# EAGLE design 89c2051-ibm3104-ps2 (EAGLE 4.16)
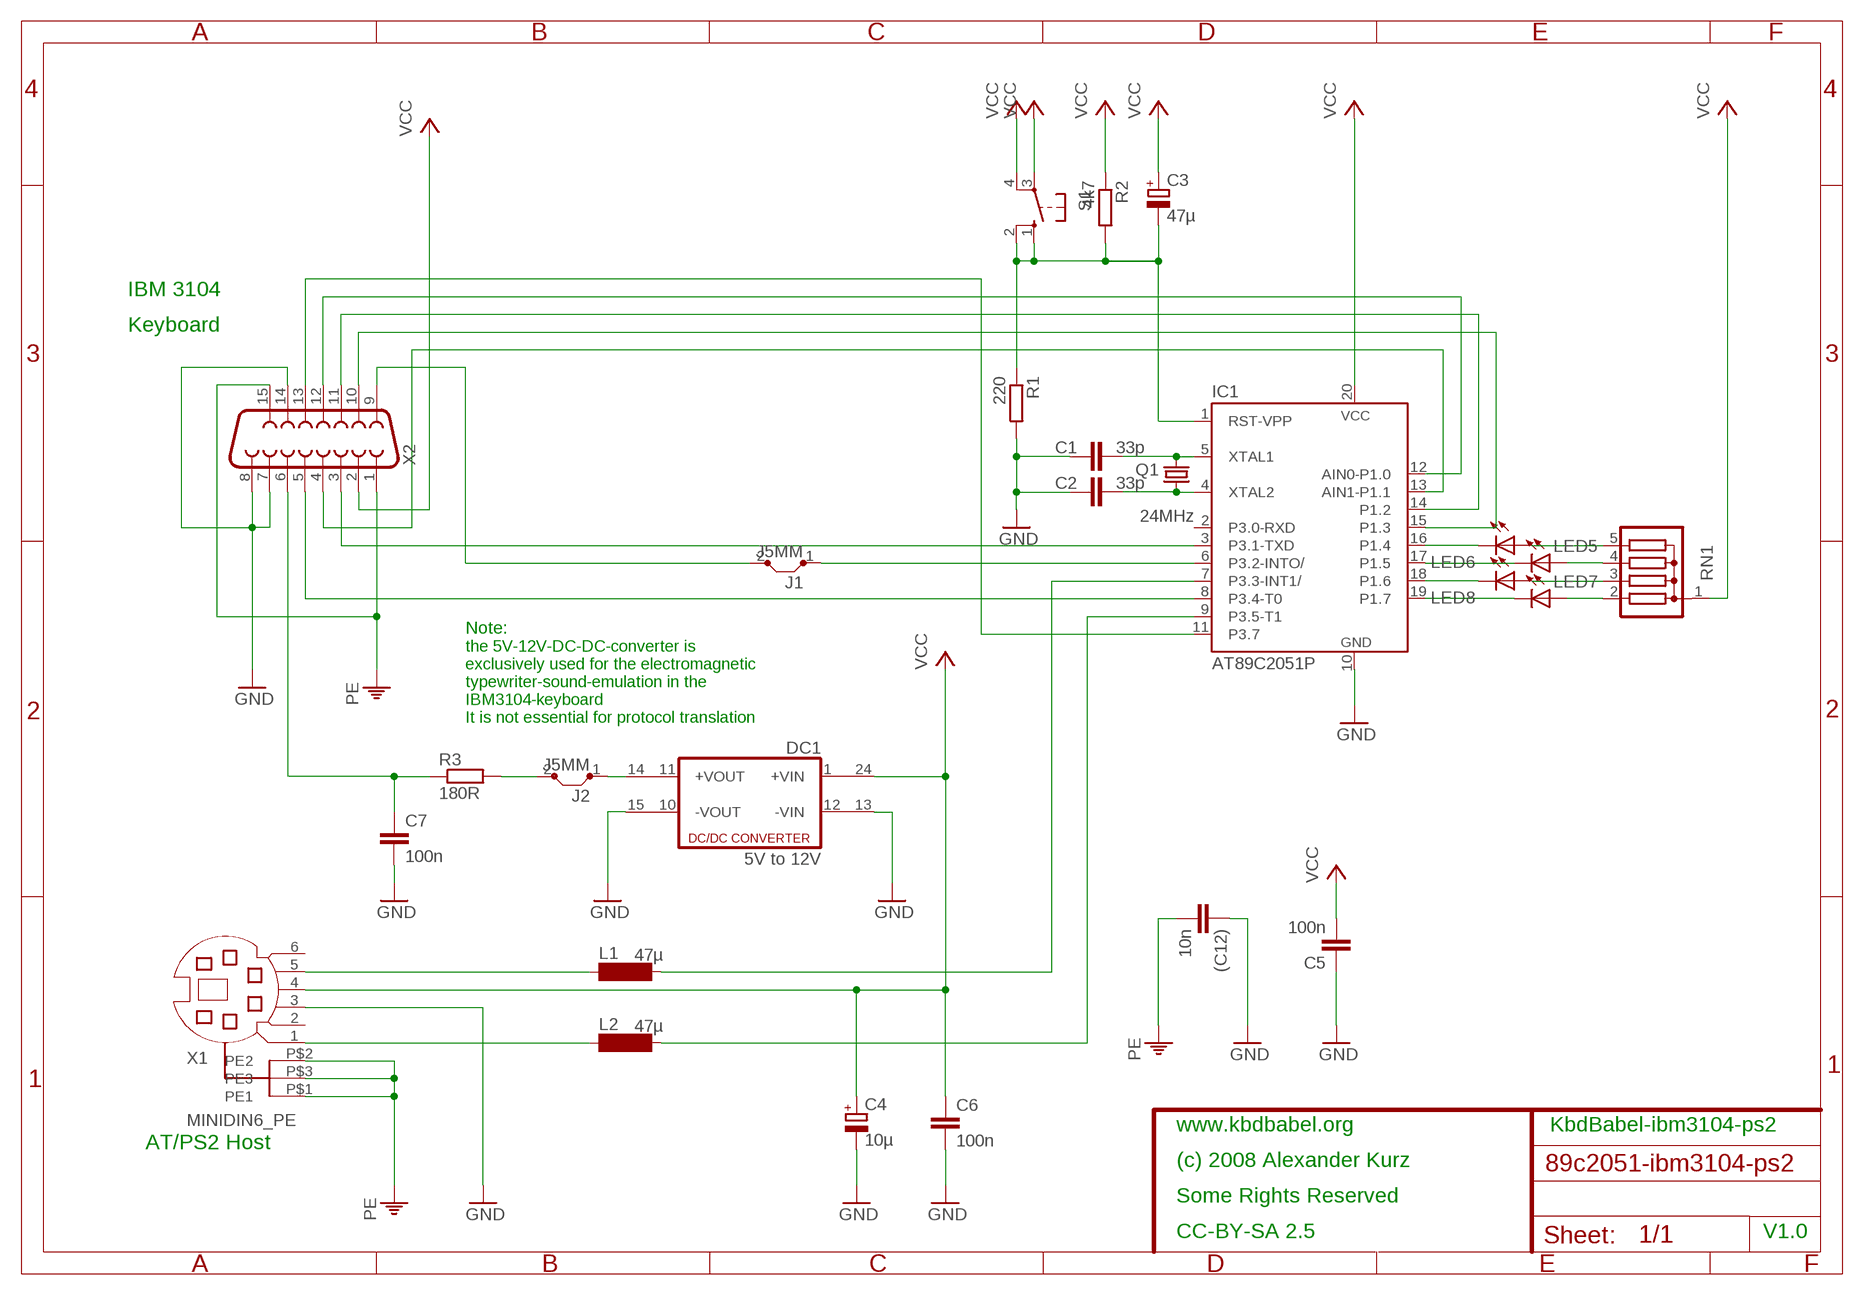
[diagram p0: schematic, sheet 1]

## Parts
(C12)  10n  C-EUC1206K  [C1206K]
C1  33p  C-EUC0805K  [C0805K]
C2  33p  C-EUC0805K  [C0805K]
C3  47µ  CPOL-EUE2-5  [E2-5]
C4  10µ  CPOL-EUE2-5  [E2-5]
C5  100n  C-EUC1206K  [C1206K]
C6  100n  C-EUC1206K  [C1206K]
C7  100n  C-EUC1206K  [C1206K]
DC1  5V to 12V  DC213R  [CMK]
IC1  AT89C2051P  [DIL20]
J1  J5MM  [05]
J2  J5MM  [05]
L1  47µ  SD75  [SD75]
L2  47µ  SD75  [SD75]
LED5  LEDSQR2X5  [LED2X5]
LED6  LEDSQR2X5  [LED2X5]
LED7  LEDSQR2X5  [LED2X5]
LED8  LEDSQR2X5  [LED2X5]
Q1  24MHz  CRYSTALHC49U70  [HC49U70]
R1  220  R-EU_R1206  [R1206]
R2  4k7  R-EU_R1206  [R1206]
R3  180R  R-EU_0204/7  [0204/7]
RN1  G04R  [SIL5]
S1  10-XX  [B3F-10XX]
X1  MINIDIN6_PE  [MINIDIN6_PE]
X2  F15HP  [F15HP]

## Nets
GND: (C12).1 C1.1 C2.2 C4.- C5.1 C6.2 C7.2 DC1.13(-VIN1) DC1.15(-VOUT1) IC1.10(GND) R1.2 X1.3 X2.7 X2.8 X2.14
N$1: C1.2 IC1.5(XTAL1) Q1.2
N$2: C2.1 IC1.4(XTAL2) Q1.1
N$3: J1.2 X2.9
N$4: IC1.12(AIN0-P1.0) X2.12
N$5: IC1.17(P1.5) LED6.K(C)
N$6: IC1.8(P3.4-T0) X2.5
N$7: IC1.13(AIN1-P1.1) X2.4
N$8: IC1.6(P3.2-INTO/) J1.1
N$9: DC1.14(+VOUT1) J2.1
N$10: J2.2 R3.2
N$11: L2.1 X1.1
N$12: IC1.9(P3.5-T1) L2.2
N$13: IC1.11(P3.7) X2.13
N$15: IC1.15(P1.3) X2.10
N$16: LED5.A RN1.5
N$17: IC1.14(P1.2) X2.11
N$18: IC1.3(P3.1-TXD) X2.3
N$19: LED6.A RN1.4
N$20: IC1.18(P1.6) LED7.K(C)
N$21: LED8.A RN1.2
N$22: LED7.A RN1.3
N$23: IC1.19(P1.7) LED8.K(C)
N$24: IC1.16(P1.4) LED5.K(C)
N$29: C7.1 R3.1 X2.6
N$41: IC1.7(P3.3-INT1/) L1.2
N$42: L1.1 X1.5
PE: (C12).2 X1.P$1(PE1) X1.P$2(PE2) X1.P$3(PE3) X2.1 X2.15
RST_2: C3.- IC1.1(RST-VPP) R1.1 R2.2 S1.1(S) S1.2(S1)
VCC: C3.+ C4.+ C5.2 C6.1 DC1.24(+VIN1) IC1.20(VCC) R2.1 RN1.1 S1.3(P) S1.4(P1) X1.4 X2.2
Unconnected: DC1.1(+VIN) DC1.10(-VOUT) DC1.11(+VOUT) DC1.12(-VIN) IC1.2(P3.0-RXD) X1.2 X1.6

## Notes on the sheet
- IBM 3104
- Keyboard
- Note:
- the 5V-12V-DC-DC-converter is
- exclusively used for the electromagnetic
- typewriter-sound-emulation in the
- IBM3104-keyboard
- It is not essential for protocol translation
- www.kbdbabel.org | KbdBabel-ibm3104-ps2
- AT/PS2 Host
- (c) 2008 Alexander Kurz
- Some Rights Reserved
- CC-BY-SA 2.5 | V1.0

## Library data of the parts
(C12) C1 C2 C5-C7 = rcl:C-EU: CAPACITOR, European symbol
C3 C4 = rcl:CPOL-EU: POLARIZED CAPACITOR, European symbol
DC1 = dc-dc-converter:DC213R: DC-DC CONVERTER
IC1 = atmel:AT89C2051: 80C31 MICROCONTROLLER 2 Kbytes FLASH 2.7 V
J1 J2 = jumper:J: Bridge
L1 L2 = inductor-neosid:SD75: INDUCTOR nominal inductance, E12
LED5-LED8 = led:LED: LED OSRAM: - CHIPLED LG R971, LG N971, LY N971, LG Q971, LY Q971, LO R971, LY R971 LH N974, LH R974 LS Q976, LO Q976, LY Q976 LO Q996 - Hyper CHIPLED LW Q18S LB Q993, LB Q99A, LB R99A - SideLED LS A670, LO A670, LY A670, LG A670, LP A670 LB A673, LV A673, LT A673, LW A673 LH A674 LY A675 LS A676, LA A676, LO A676, LY A676, LW A676 LS A679, LY A679, LG A679 - Hyper Micro SIDELED® LS Y876, LA Y876, LO Y876, LY Y876 LT Y87S - SmartLED LW L88C, LW L88S LB L89C, LB L89S, LG L890 LS L89K, LO L89K, LY L89K LS L896, LA L896, LO L896, LY L896 - TOPLED LS T670, LO T670, LY T670, LG T670, LP T670 LSG T670, LSP T670, LSY T670, LOP T670, LYG T670 LG T671, LOG T671, LSG T671 LB T673, LV T673, LT T673, LW T673 LH T674 LS T676, LA T676, LO T676, LY T676, LB T676, LH T676, LSB T676, LW T676 LB T67C, LV T67C, LT T67C, LS T67K, LO T67K, LY T67K, LW E67C LS E67B, LA E67B, LO E67B, LY E67B, LB E67C, LV E67C, LT E67C LW T67C LS T679, LY T679, LG T679 LS T770, LO T770, LY T770, LG T770, LP T770 LB T773, LV T773, LT T773, LW T773 LH T774 LS E675, LA E675, LY E675, LS T675 LS T776, LA T776, LO T776, LY T776, LB T776 LHGB T686 LT T68C, LB T68C - Hyper Mini TOPLED® LB M676 - Mini TOPLED Santana® LG M470 LS M47K, LO M47K, LY M47K Source: http://www.osram.convergy.de - LUMILED® LXK2-PW12-R00, LXK2-PW12-S00, LXK2-PW14-U00, LXK2-PW14-V00 LXK2-PM12-R00, LXK2-PM12-S00, LXK2-PM14-U00 LXK2-PE12-Q00, LXK2-PE12-R00, LXK2-PE12-S00, LXK2-PE14-T00, LXK2-PE14-U00 LXK2-PB12-K00, LXK2-PB12-L00, LXK2-PB12-M00, LXK2-PB14-N00, LXK2-PB14-P00, LXK2-PB14-Q00 LXK2-PR12-L00, LXK2-PR12-M00, LXK2-PR14-Q00, LXK2-PR14-R00 LXK2-PD12-Q00, LXK2-PD12-R00, LXK2-PD12-S00 LXK2-PH12-R00, LXK2-PH12-S00 LXK2-PL12-P00, LXK2-PL12-Q00, LXK2-PL12-R00 Source: www.luxeon.com
Q1 = crystal:CRYSTAL: CRYSTAL
R1-R3 = rcl:R-EU_: RESISTOR, European symbol
RN1 = resistor-sil:G04R: SIL RESISTOR
S1 = switch-omron:10-XX: OMRON SWITCH
X1 = bla:MINIDIN6_PE
X2 = con-subd:F15: SUB-D

## Board
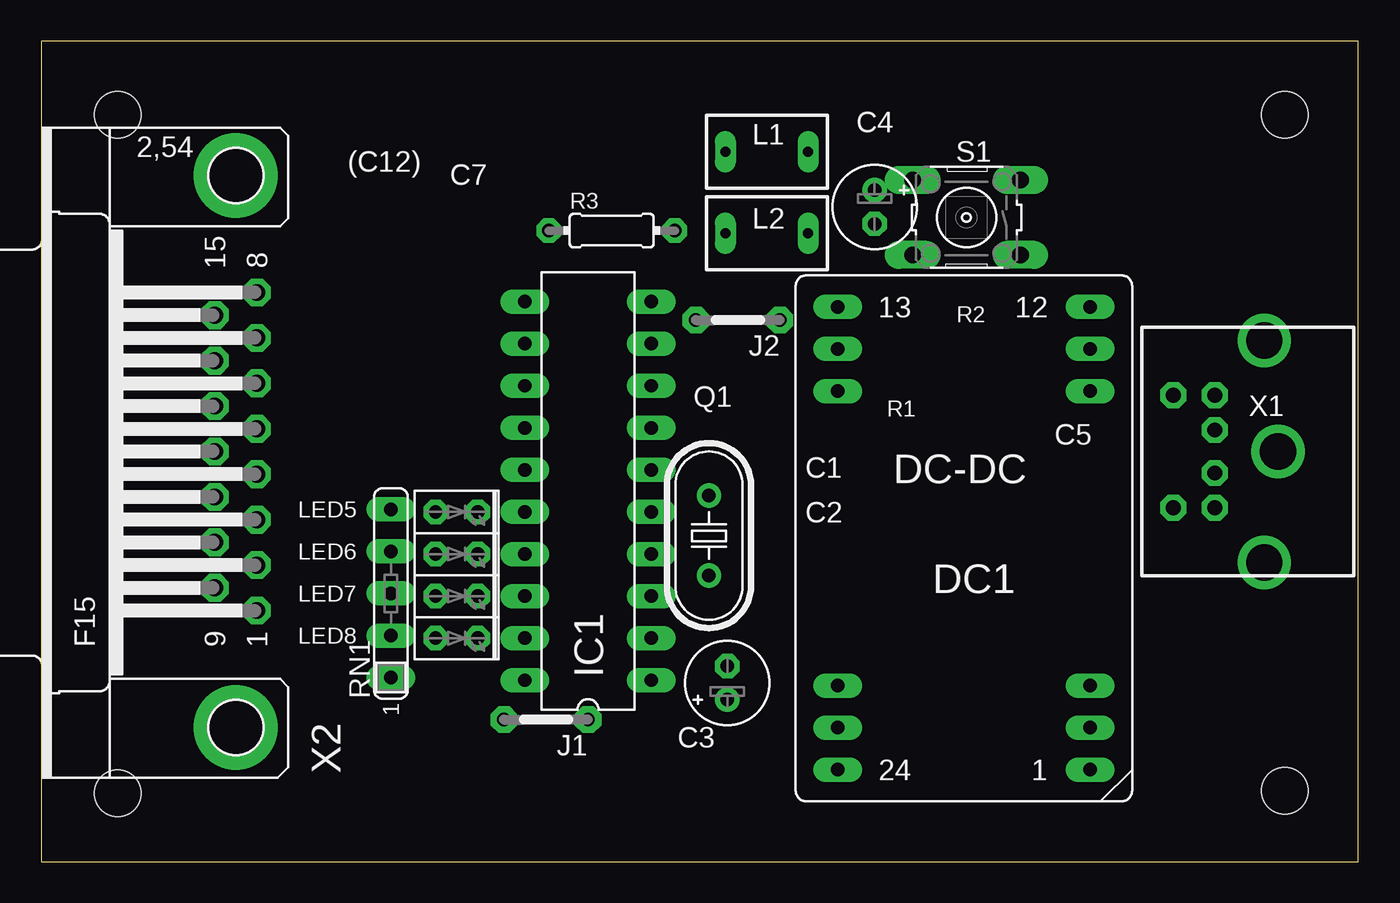
[diagram p1: board, top side]
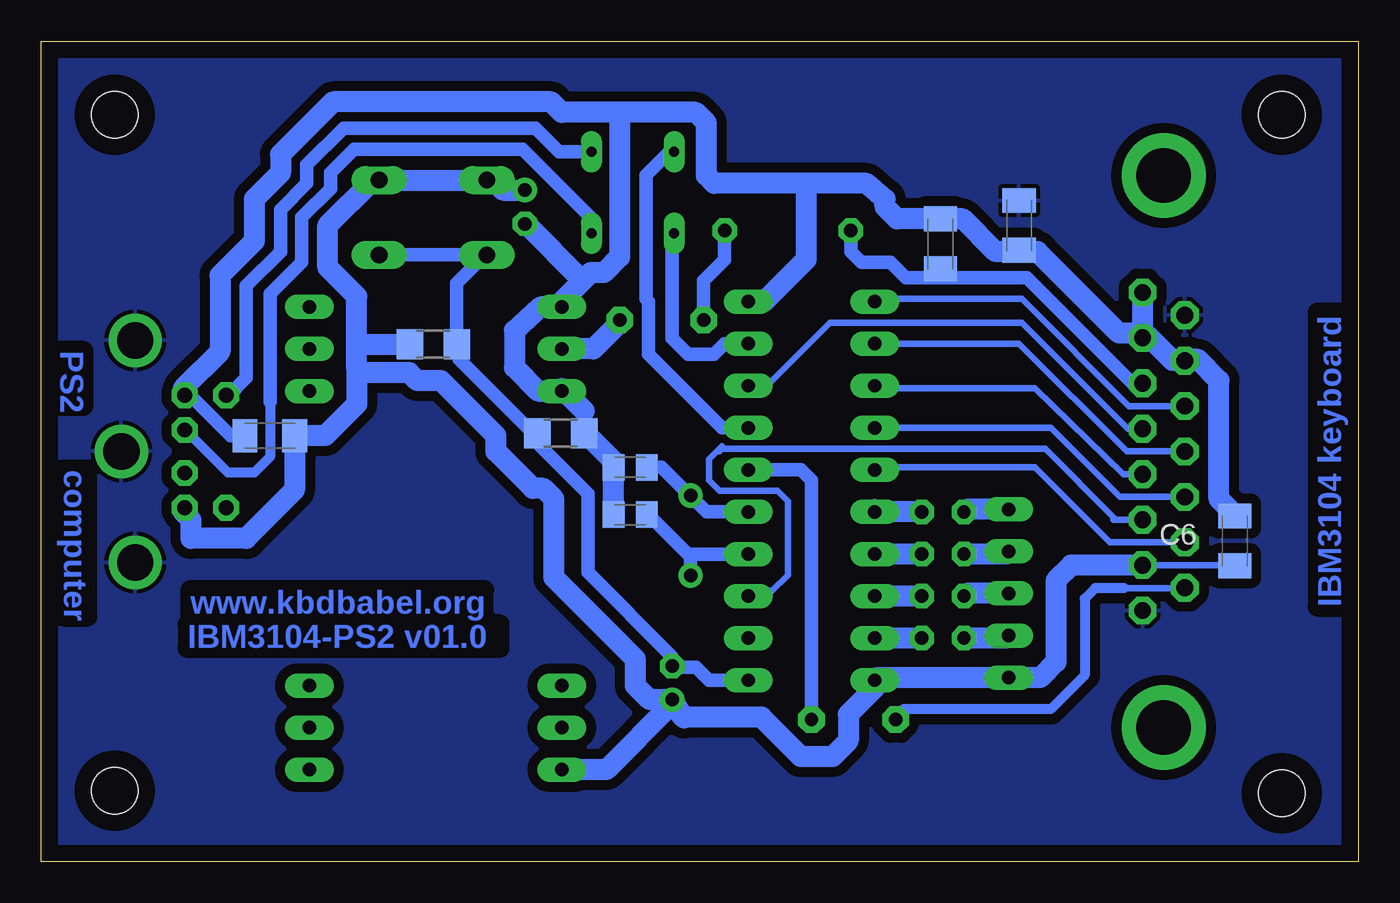
[diagram p2: board, bottom side, seen from below]

Size 79.52 x 49.52 mm. Coordinates in mm from the lower left corner, seen from the top.
Outline: 79.52,0 79.52,49.52 0,49.52 0,0 79.52,0
Copper layers (1*16): Top 0.035mm / dielectric 1.5mm / Bottom 0.035mm
Design rules "default": minimum track width 16mil, minimum drill 24mil, track to track 12mil, track to pad 12mil, pad to pad 16mil, via to via 16mil, smd to smd 16mil, copper to edge 40mil, drill to drill 8mil, minimum pad ring 13mil, minimum via ring 8mil, stop-mask expansion 4mil, vias tented up to drill 0mil, thermal gap 10mil
Holes 2.8 mm at 75.08,4.28 75.08,45.08 4.6,45.08 4.6,4.12

### Footprints (pad centres in the part's own frame; a part is rotated, then mirrored left to right if it is on the bottom)
C1206K = smd 1.5 x 2: 1 -1.5,0; 2 1.5,0
C0805K = smd 1.3 x 1.6: 1 -1,0; 2 1,0
E2-5 = drill 0.813 pad 1.27 round: + -1.016,0 | drill 0.813 pad 1.27 octagon: - 1.016,0
CMK = drill 0.813 long: 1 -7.62,13.97; 2 -7.62,11.43; 3 -7.62,8.89; 10 -7.62,-8.89; 11 -7.62,-11.43; 12 -7.62,-13.97; 13 7.62,-13.97; 14 7.62,-11.43; 15 7.62,-8.89; 22 7.62,8.89; 23 7.62,11.43; 24 7.62,13.97
DIL20 = drill 0.813 long: 1 -11.43,-3.81; 2 -8.89,-3.81; 3 -6.35,-3.81; 4 -3.81,-3.81; 5 -1.27,-3.81; 6 1.27,-3.81; 7 3.81,-3.81; 8 6.35,-3.81; 9 8.89,-3.81; 10 11.43,-3.81; 11 11.43,3.81; 12 8.89,3.81; 13 6.35,3.81; 14 3.81,3.81; 15 1.27,3.81; 16 -1.27,3.81; 17 -3.81,3.81; 18 -6.35,3.81; 19 -8.89,3.81; 20 -11.43,3.81
05 = drill 0.813 pad 1.6 octagon: 1 -2.54,0; 2 2.54,0
SD75 = drill 0.6 long: 1 -2.5,0; 2 2.5,0
LED2X5 = drill 0.813 octagon: A -1.27,0; K 1.27,0
HC49U70 = drill 0.813 round: 1 -2.413,0; 2 2.413,0
R1206 = smd 1.6 x 1.803: 1 -1.422,0; 2 1.422,0
0204/7 = drill 0.813 octagon: 1 -3.81,0; 2 3.81,0
SIL5 = drill 0.813 long: 1 -5.08,0; 2 -2.54,0; 3 0,0; 4 2.54,0; 5 5.08,0
B3F-10XX = drill 1.016 long: 1 -3.251,2.261; 2 3.251,2.261; 3 -3.251,-2.261; 4 3.251,-2.261
MINIDIN6_PE = drill 0.9 octagon: 1 1.3,2.15; 2 -1.3,2.15; 3 3.4,2.15; 4 -3.4,2.15; 5 3.4,4.65; 6 -3.4,4.65 | drill 2.2 round: P$1 0,-1.676; P$2 -6.706,-0.838; P$3 6.706,-0.838
F15HP = drill 1.016 octagon: 1 -9.601,-1.27; 2 -6.858,-1.27; 3 -4.115,-1.27; 4 -1.372,-1.27; 5 1.372,-1.27; 6 4.115,-1.27; 7 6.858,-1.27; 8 9.601,-1.27; 9 -8.23,1.27; 10 -5.486,1.27; 11 -2.743,1.27; 12 0,1.27; 13 2.743,1.27; 14 5.486,1.27; 15 8.23,1.27 | drill 3.302 pad 5.08 round: G1 -16.662,0; G2 16.662,0

### Placement (x,y rotation side)
(C12)  20.47,38.41 90 bottom
C1  43.97,23.81 0 bottom
C2  43.97,20.95 180 bottom
C3  41.43,10.79 90 top
C4  50.32,39.52 270 top
C5  65.73,25.71 0 bottom
C6  7.46,19.36 90 bottom
C7  25.24,37.3 90 bottom
DC1  55.72,19.52 180 top
IC1  33.01,22.38 90 top
J1  30.48,8.57 180 top
J2  42.06,32.7 180 top
L1  43.81,42.86 180 top
L2  43.81,37.94 180 top
LED5  25.08,21.11 0 top
LED6  25.08,18.57 0 top
LED7  25.08,16.03 0 top
LED8  25.08,13.49 0 top
Q1  40.32,19.68 90 top
R1  48.16,25.87 0 bottom
R2  55.86,31.24 0 bottom
R3  34.44,38.09 0 top
RN1  21.11,16.19 90 top
S1  55.87,38.89 180 top
X1  73.02,24.76 90 top
X2  11.74,24.76 90 top

### Tracks (layer width: path | path; a pad name or v marks a point on that pad's centre or on a via)
GND
  Bottom 0.813: X1.3 70.55,28.16 68.1,25.71 67.3,25.71 | 67.3,25.71 | 67.3,25.71 C5.1 | R1.2 46.74,25.94 46.83,26.03 46.74,26.12 46.74,27.21
  Bottom 1.27: 44.97,23.92 44.92,23.96 | 44.97,23.92 C1.1 44.97,24.17 46.67,25.87 R1.2 | C2.2 44.97,23.92 | 44.97,23.92 | 70.96,28.09 70.89,28.16 X1.3 70.87,28.48 70.96,28.57 68.73,30.79 68.73,35.39 66.67,37.46 66.67,40 65.08,41.59 65.08,42.7 61.91,45.87 48.73,45.87 48.1,45.24 44.6,45.24 | 35.87,33.81 33.33,36.35 33.33,40.95 | 35.87,33.81 | DC1.13 48.1,33.81 46.83,35.08 | 46.83,35.08 46.35,35.55 45.56,35.55 44.6,36.51 44.6,45.24 | X2.7 12.82,31.62 12.69,31.74 11.2,30.24 X2.14 10.4,30.24 10.31,30.16 10.15,30.31 9.68,30.31 8.41,29.04 8.41,21.9 7.46,20.95 C6.2 | 13.09,34.36 13.17,34.44 | 13.09,34.36 X2.8 | X2.7 13.01,34.28 13.09,34.36 | 20.31,36.82 19.36,36.82 14.44,31.9 13.33,31.9 13.01,31.58 X2.7 | 20.31,36.82 21.9,36.82 23.88,38.8 C7.2 27.85,38.8 28.57,39.52 28.57,40 29.68,40.95 33.33,40.95 | 20.31,36.82 20.31,36.98 20.39,36.91 (C12).1 | 33.33,40.95 38.89,40.95 39.36,41.43 39.36,44.6 40,45.24 44.6,45.24 | 46.83,35.08 | C4.- 50.25,38.51 46.83,35.08 | 48.1,28.57 | 48.1,28.57 DC1.15 49.52,28.41 50.95,29.84 50.95,32.06 49.37,33.49 DC1.13 | 48.1,28.57 46.74,27.21 | DC1.13 | 35.87,33.81 IC1.10 | 35.87,33.81
N$1
  Bottom 0.813: IC1.5 39.36,21.11 40.32,22.06 Q1.2 40.35,22.09 42.06,23.81 C1.2
N$2
  Bottom 0.813: C2.1 42.86,20.95 40.48,18.57 40.32,18.57 | 40.32,18.57 IC1.4 | 40.32,18.57 | Q1.1 40.32,18.57
N$3
  Bottom 0.406: X2.9 10.47,16.5 14.12,16.5
  Bottom 0.61: J1.2 27.93,8.72 27.46,9.2 18.57,9.2 16.5,11.26 16.5,15.87 15.87,16.5 14.12,16.5
N$4
  Bottom 0.406: IC1.12 | X2.12 13.96,24.76 20.47,31.27 29.05,31.27 29.2,31.11 IC1.12
N$5
  Bottom 1.27: LED6.K IC1.17
N$6
  Bottom 0.406: X2.5 13.91,26.13 20.31,32.54 31.9,32.54 35.71,28.73 36.98,28.73 | 36.98,28.73 | 36.98,28.73 IC1.8
N$7
  Bottom 0.406: X2.4 14.18,23.39 19.52,28.57 28.09,28.57 29.05,28.73 IC1.13
N$8
  Bottom 0.813: IC1.6 33.65,23.65 33.01,23.01 J1.1 | J1.1 | 32.86,8.41 J1.1
N$9
  Bottom 1.27: J2.1 44.6,32.54 46.19,30.95 DC1.14
N$10
  Bottom 0.813: J2.2 39.52,35.08 38.25,36.35 R3.2
N$11
  Bottom 0.61: 65.72,27.77 65.72,24.44 66.67,23.49 68.26,23.49 70.83,26.06 X1.1
  Bottom 0.813: L2.1 46.31,38.85 50.48,43.01 60.64,43.01 62.07,41.59 62.07,40.63 63.81,38.89 63.81,36.19 65.72,34.28 65.72,27.77
N$12
  Bottom 0.813: IC1.9 38.25,31.27 38.89,30.63 40.48,30.63 41.43,31.58 41.43,37.62 41.27,37.78 41.31,37.82 L2.2
N$13
  Bottom 0.406: X2.13 13.85,27.5 20.31,33.97 28.89,33.97 29.05,33.81 IC1.11
N$15
  Bottom 0.406: X2.10 14.99,19.27 19.52,23.81 29.05,23.81 IC1.15 | IC1.15
N$16
  Bottom 1.27: LED5.A 23.65,21.27 RN1.5
N$17
  Bottom 0.406: IC1.14 | X2.11 14.4,22.02 18.57,26.19 IC1.14 | IC1.14
N$18
  Bottom 0.406: IC1.3 | X2.3 14.77,20.64 14.77,20.8 18.89,24.92 38.41,24.92 38.57,24.76 38.65,24.84 | 38.65,24.84 39.21,24.28 39.21,23.01 38.57,22.38 35.08,22.38 34.44,21.74 34.44,17.3 35.4,16.34 36.67,16.34 36.98,16.03 IC1.3 | 38.65,24.84 38.41,25.08 | 38.65,24.84
N$19
  Bottom 1.27: RN1.4 21.27,18.57 LED6.A
N$20
  Bottom 1.27: LED7.K IC1.18
N$21
  Bottom 1.27: RN1.2 | LED8.A 21.27,13.49 RN1.2
N$22
  Bottom 1.27: LED7.A 23.65,16.19 RN1.3
N$23
  Bottom 1.27: LED8.K IC1.19
N$24
  Bottom 1.27: 29.2,21.27 | 29.2,21.27 IC1.16 | LED5.K 29.05,21.11 29.2,21.27
N$29
  Bottom 0.813: X2.6 13.63,28.87 20,35.24 25.24,35.24 | 25.24,35.24 27.3,35.24 28.25,36.19 30,36.19 30.63,36.82 R3.1 | 25.24,35.24 C7.1
N$41
  Bottom 0.813: L1.2 41.59,42.86 43.02,41.43 43.02,33.97 42.86,33.81 42.86,30.63 38.41,26.19 IC1.7 | IC1.7
N$42
  Bottom 0.813: L1.1 48.25,42.86 49.68,44.28 61.27,44.28 63.49,42.06 63.49,40.95 65.08,39.36 65.08,36.82 67.15,34.76 67.15,29.2 68.26,28.09 68.32,28.16 X1.5
PE
  pour Bottom (isolate 0.61): 79.69,-0.17 79.69,49.68 -0.16,49.68 -0.16,-0.17
RST_2
  Bottom 0.813: IC1.1 39.21,10.95 40,11.74 41.43,11.74 | 41.43,11.74 | 41.43,11.74 C3.- 41.43,12.38 46.51,17.46 46.51,22.22 49.52,25.23 49.52,25.71 49.68,25.87 | 49.68,25.87 | 49.68,25.87 R1.1 49.84,25.87 54.29,30.31 54.29,31.11 54.44,31.26 | 54.44,31.26 54.45,31.27 | 54.44,31.26 R2.2 54.44,34.92 52.7,36.66 52.66,36.63 S1.2 59.09,36.63 59.13,36.59 | 59.13,36.59 59.21,36.51 | 59.13,36.59 S1.1
VCC
  Bottom 0.406: 7.46,17.93 | C6.1 7.46,17.93 | X2.2 7.49,17.9 7.46,17.93
  Bottom 1.27: 20.95,11.11 20,11.11 | IC1.20 29.36,10.79 | IC1.20 | 25.39,11.11 RN1.1 20.95,11.11 | 25.39,11.11 29.05,11.11 IC1.20 | 25.39,11.11 | X2.2 17.33,17.9 18.25,16.98 18.25,12.06 19.2,11.11 20.95,11.11 | IC1.20 29.2,10.47 30.79,8.88 30.79,7.3 31.74,6.34 33.65,6.34 36.03,8.72 40.79,8.72 C3.+ | C3.+ 40.7,8.66 | X1.4 70.87,21.19 70.96,21.11 70.48,20.63 70.48,19.52 67.15,19.52 64.23,22.44 C5.2 64.13,25.71 | 60.48,29.68 60.48,27.62 62.38,25.71 64.13,25.71 | 60.48,29.68 60.48,31.11 | 60.48,31.11 60.48,34.12 62.22,35.87 62.22,38.41 59.49,41.15 S1.3 59.13,41.19 59.05,41.27 58.93,41.15 S1.4 52.5,41.15 52.38,41.27 51.65,40.54 C4.+ | 64.13,25.71 | C3.+ 42.79,9.77 43.65,10.63 43.65,12.22 48.57,17.14 48.57,21.9 49.21,22.54 49.84,22.54 52.06,24.76 52.06,25.71 55.4,29.04 56.83,29.04 57.3,29.52 60.32,29.52 60.48,29.68 | R2.1 60.34,31.24 60.48,31.11 | C3.+ 41.43,9.52 45.4,5.55 DC1.24

### Text on the board
Bottom: PS2 | computer | IBM3104 keyboard | www.kbdbabel.org | IBM3104-PS2 v01.0